# EAGLE design RxT6 (EAGLE 4.13)
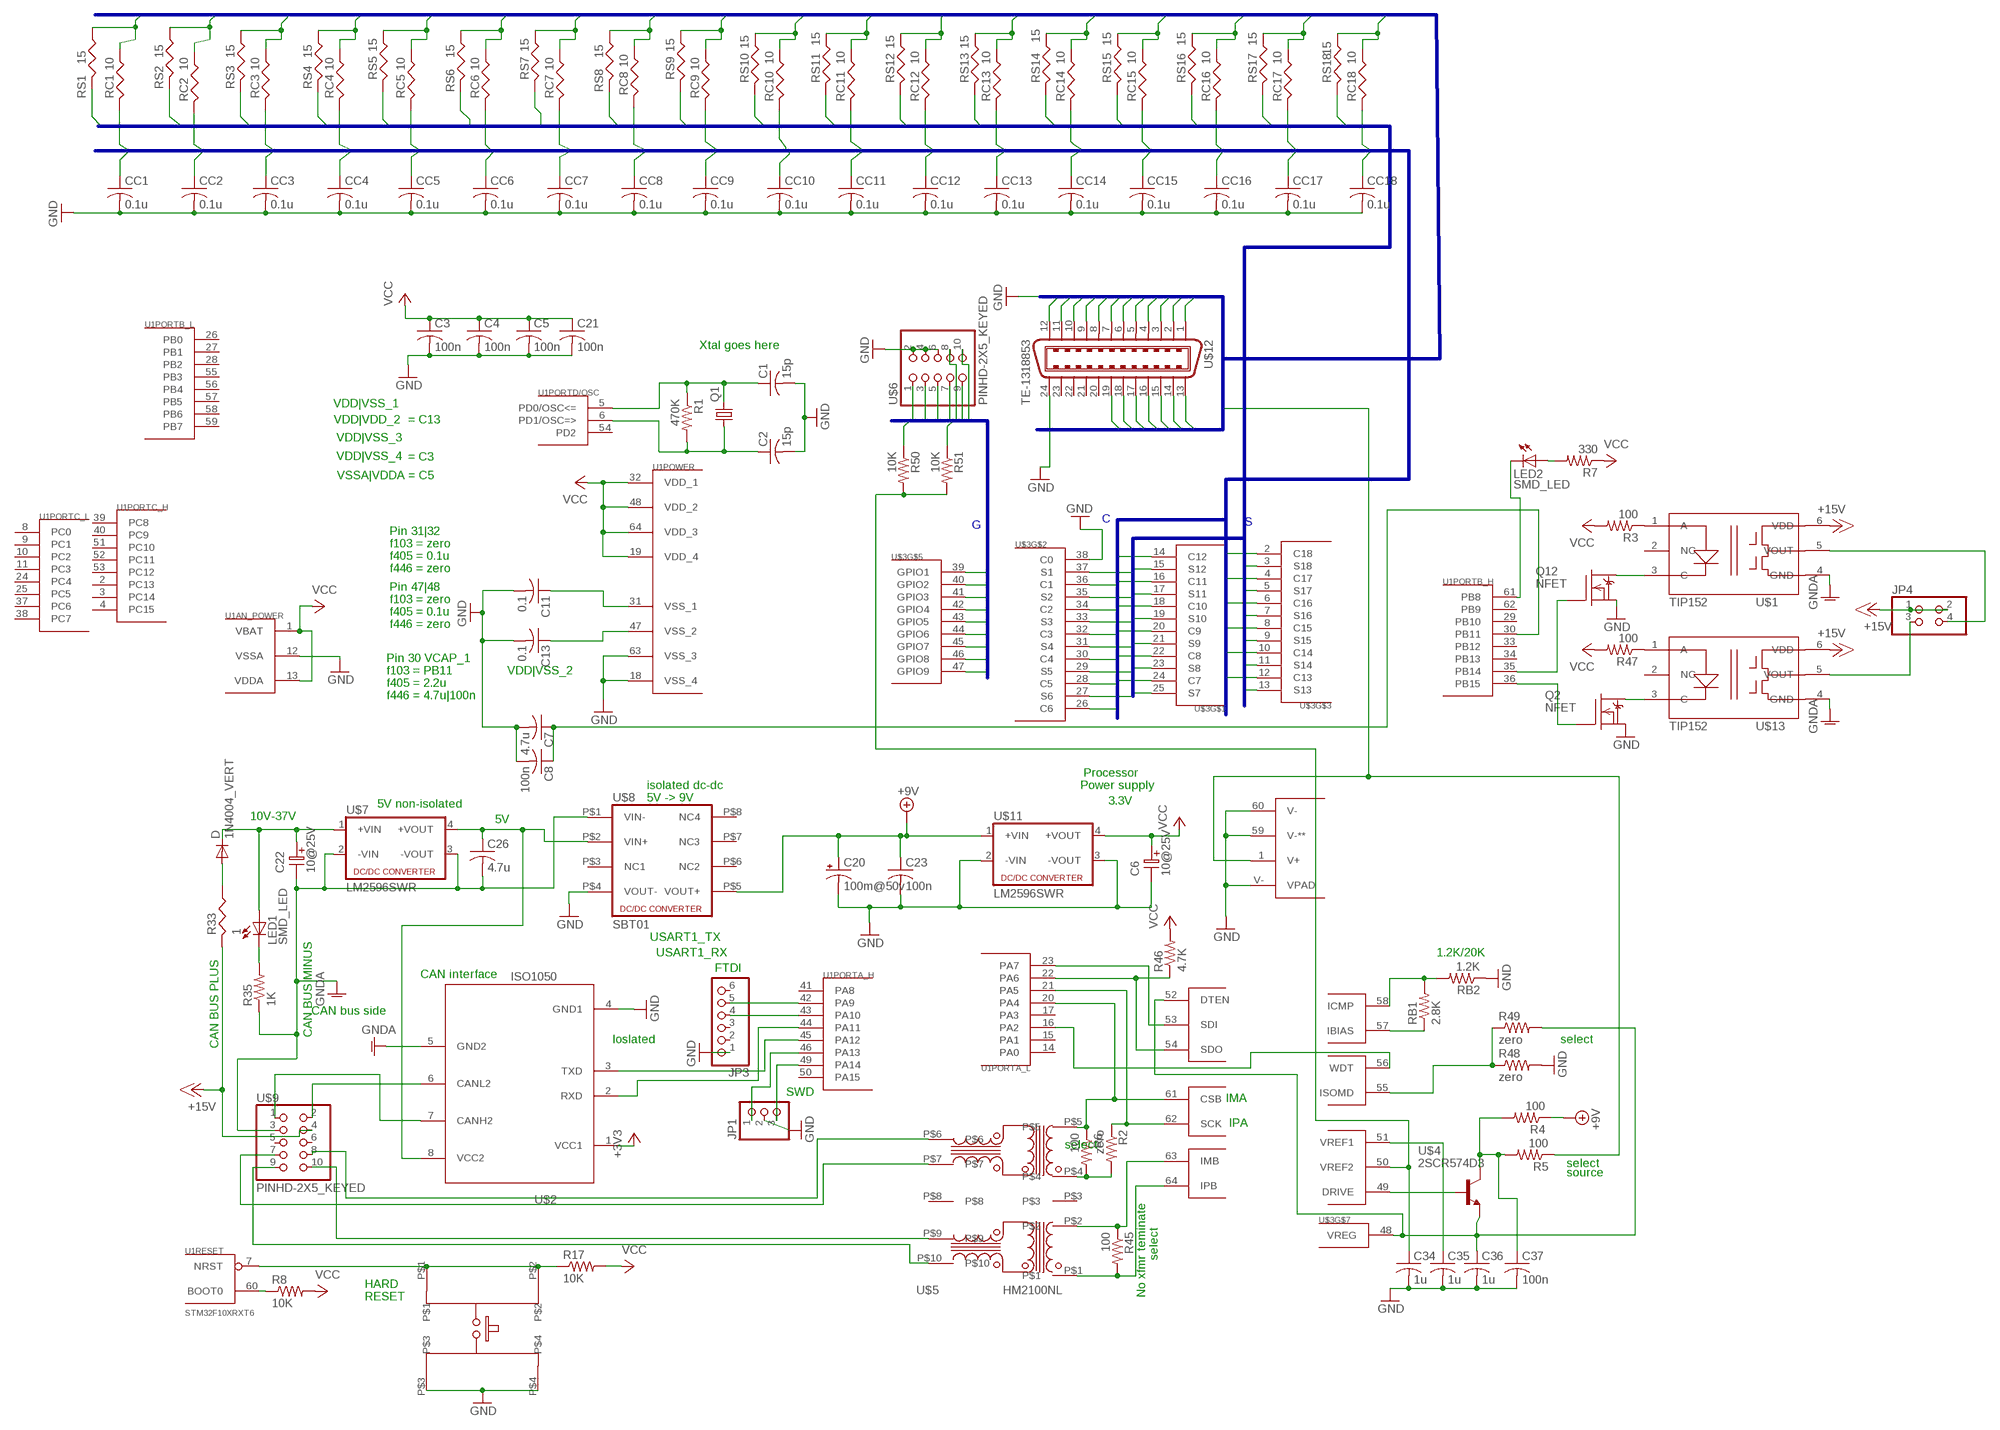
[diagram p0: schematic, sheet 1]

## Parts
C1  15p  C-USC0603  [C0603]
C2  15p  C-USC0603  [C0603]
C3  100n  C-USC0603  [C0603]
C4  100n  C-USC0603  [C0603]
C5  100n  C-USC0603  [C0603]
C6  10@25V  ELC-2,5L  [ES-2,5L]
C7  4.7u  C-USC0603  [C0603]
C8  100n  C-USC0603  [C0603]
C11  0.1  C-USC0603  [C0603]
C13  0.1  C-USC0603  [C0603]
C20  100m@50v  CPOL-USE5-8.5  [E5-8,5]
C21  100n  C-USC0603  [C0603]
C22  10@25V  ELC-2,5L  [ES-2,5L]
C23  100n  C-USC0603  [C0603]
C26  4.7u  C-USC0603  [C0603]
C34  1u  C-USC0603  [C0603]
C35  1u  C-USC0603  [C0603]
C36  1u  C-USC0603  [C0603]
C37  100n  C-USC0603  [C0603]
CC1  0.1u  C-USC0805  [C0805]
CC2  0.1u  C-USC0805  [C0805]
CC3  0.1u  C-USC0805  [C0805]
CC4  0.1u  C-USC0805  [C0805]
CC5  0.1u  C-USC0805  [C0805]
CC6  0.1u  C-USC0805  [C0805]
CC7  0.1u  C-USC0805  [C0805]
CC8  0.1u  C-USC0805  [C0805]
CC9  0.1u  C-USC0805  [C0805]
CC10  0.1u  C-USC0805  [C0805]
CC11  0.1u  C-USC0805  [C0805]
CC12  0.1u  C-USC0805  [C0805]
CC13  0.1u  C-USC0805  [C0805]
CC14  0.1u  C-USC0805  [C0805]
CC15  0.1u  C-USC0805  [C0805]
CC16  0.1u  C-USC0805  [C0805]
CC17  0.1u  C-USC0805  [C0805]
CC18  0.1u  C-USC0805  [C0805]
D  1N4004_VERT  [DO41-10_VERT]
JP1  PINHD-1X3  [1X03]
JP3  PINHD-1X6  [1X06]
JP4  PINHD-2X2  [2X02]
LED1  SMD_LED  [SMD_LED]
LED2  SMD_LED  [SMD_LED]
Q1  CRYTALHC49S  [HC49/S]
Q2  NFET  DMN3404L  [SOT-23]
Q12  NFET  DMN3404L  [SOT-23]
R1  470K  R-US_R0603  [R0603]
R2  zero  R-US_R0603  [R0603]
R3  100  R-US_R0603  [R0603]
R4  100  R-US_R0603  [R0603]
R5  100  R-US_R0603  [R0603]
R6  100  R-US_R0603  [R0603]
R7  330  R-US_R0603  [R0603]
R8  10K  R-US_R0603  [R0603]
R17  10K  R-US_R0603  [R0603]
R33  1  RESUS-S2,5  [RS-2,5]
R35  1K  R-US_R0603  [R0603]
R45  100  R-US_R0603  [R0603]
R46  4.7K  R-US_R0603  [R0603]
R47  100  R-US_R0603  [R0603]
R48  zero  R-US_R0603  [R0603]
R49  zero  R-US_R0603  [R0603]
R50  10K  R-US_R0603  [R0603]
R51  10K  R-US_R0603  [R0603]
RB1  2.8K  R-US_R0603  [R0603]
RB2  1.2K  R-US_R0603  [R0603]
RC1  10  RESUS-S2,5  [RS-2,5]
RC2  10  RESUS-S2,5  [RS-2,5]
RC3  10  RESUS-S2,5  [RS-2,5]
RC4  10  RESUS-S2,5  [RS-2,5]
RC5  10  RESUS-S2,5  [RS-2,5]
RC6  10  RESUS-S2,5  [RS-2,5]
RC7  10  RESUS-S2,5  [RS-2,5]
RC8  10  RESUS-S2,5  [RS-2,5]
RC9  10  RESUS-S2,5  [RS-2,5]
RC10  10  RESUS-S2,5  [RS-2,5]
RC11  10  RESUS-S2,5  [RS-2,5]
RC12  10  RESUS-S2,5  [RS-2,5]
RC13  10  RESUS-S2,5  [RS-2,5]
RC14  10  RESUS-S2,5  [RS-2,5]
RC15  10  RESUS-S2,5  [RS-2,5]
RC16  10  RESUS-S2,5  [RS-2,5]
RC17  10  RESUS-S2,5  [RS-2,5]
RC18  10  RESUS-S2,5  [RS-2,5]
RS1  15  RESUS-S2,5  [RS-2,5]
RS2  15  RESUS-S2,5  [RS-2,5]
RS3  15  RESUS-S2,5  [RS-2,5]
RS4  15  RESUS-S2,5  [RS-2,5]
RS5  15  RESUS-S2,5  [RS-2,5]
RS6  15  RESUS-S2,5  [RS-2,5]
RS7  15  RESUS-S2,5  [RS-2,5]
RS8  15  RESUS-S2,5  [RS-2,5]
RS9  15  RESUS-S2,5  [RS-2,5]
RS10  15  RESUS-S2,5  [RS-2,5]
RS11  15  RESUS-S2,5  [RS-2,5]
RS12  15  RESUS-S2,5  [RS-2,5]
RS13  15  RESUS-S2,5  [RS-2,5]
RS14  15  RESUS-S2,5  [RS-2,5]
RS15  15  RESUS-S2,5  [RS-2,5]
RS16  15  RESUS-S2,5  [RS-2,5]
RS17  15  RESUS-S2,5  [RS-2,5]
RS18  15  RESUS-S2,5  [RS-2,5]
SW1  E-SWITCH  [E-SWITCH]
U1  STM32F10XRXT6  [TQFP64]
U$1  TIP152  SI826  [SDIP6]
U$2  ISO1050  [PDSO-G8]
U$3  LTC6813  [TQFP64_PAD]
U$4  2SCR574D3  [TO252]
U$5  HM2100NL  [PULSE]
U$6  PINHD-2X5_KEYED  [2X05_KEYED]
U$7  LM2596SWR  [LM2596SW]
U$8  SBT01  [SBT01]
U$9  PINHD-2X5_KEYED  [2X05_KEYED]
U$11  LM2596SWR  [LM2596SW]
U$12  TE-1318853  [TE-CONN-24]
U$13  TIP152  SI826  [SDIP6]

## Nets
5V_CANSIDE: C26.1 U$2.8(VCC2) U$7.4(+VOUT) U$8.P$2(VIN+)
+3V3: U$2.1(VCC1)
+9V: C20.+ C23.1 R4.1 U$8.P$5(VOUT+) U$11.1(+VIN)
+12V_RESISTORED: D.A R33.1
+15V: JP4.1 JP4.2 R33.2 U$1.6(VDD) U$9.4 U$13.6(VDD)
BOOT0: R8.1 U1.60(RESET:BOOT0)
C1: CC1.1 RC1.2 U$3.36(C1)
C2: CC2.1 RC2.2 U$3.34(C2)
C3: CC3.1 RC3.2 U$3.32(C3)
C4: CC4.1 RC4.2 U$3.30(C4)
C5: CC5.1 RC5.2 U$3.28(C5)
C6: CC6.1 RC6.2 U$3.26(C6)
C7: CC7.1 RC7.2 U$3.24(C7)
C8: CC8.1 RC8.2 U$3.22(C8)
C9: CC9.1 RC9.2 U$3.20(C9)
C10: CC10.1 RC10.2 U$3.18(C10)
C11: CC11.1 RC11.2 U$3.16(C11)
C12: CC12.1 RC12.2 U$3.14(C12)
C13: CC13.1 RC13.2 U$3.12(C13)
C14: CC14.1 RC14.2 U$3.10(C14)
C15: CC15.1 RC15.2 U$3.8(C15)
C16: CC16.1 RC16.2 U$3.6(C16)
C17: CC17.1 RC17.2 U$3.4(C17)
C18: CC18.1 RC18.2 U$3.2(C18)
CAN_PROTECTED+: C22.1 D.C LED1.A U$7.1(+VIN)
CANH: U$2.7(CANH2) U$9.1
CANL: U$2.6(CANL2) U$9.2
DRIVE: U$3.49(DRIVE) U$4.1(B)
G1: R50.1 U$3.39(GPIO1) U$6.1
G2: R51.1 U$3.40(GPIO2) U$6.3
G3: U$3.41(GPIO3) U$6.5
G4: U$3.42(GPIO4) U$6.7
G5: U$3.43(GPIO5) U$6.8
G6: U$3.44(GPIO6) U$6.9
G7: U$3.45(GPIO7) U$6.10
G8: U$3.46(GPIO8)
G9: U$3.47(GPIO9)
GND: C1.2 C2.2 C3.2 C4.2 C5.2 C6.2 C7.2 C8.2 C11.2 C13.2 C20.- C21.2 C23.2 C34.2 C35.2 C36.2 C37.2 CC1.2 CC2.2 CC3.2 CC4.2 CC5.2 CC6.2 CC7.2 CC8.2 CC9.2 CC10.2 CC11.2 CC12.2 CC13.2 CC14.2 CC15.2 CC16.2 CC17.2 CC18.2 JP1.2 JP3.1 Q2.2(S) Q12.2(S) R48.2 RB2.1 SW1.P$3 SW1.P$4 U1.12(AN_POWER:VSSA) U1.18(POWER:VSS_4) U1.63(POWER:VSS_3) U$2.4(GND1) U$3.38(C0) U$3.59(V-**) U$3.60(V-) U$3.V-(VPAD) U$6.2 U$6.4 U$6.6 U$8.P$4(VOUT-) U$11.2(-VIN) U$11.3(-VOUT) U$12.24
GNDA: C22.2 C26.2 R35.1 U$1.4(GND) U$2.5(GND2) U$7.2(-VIN) U$7.3(-VOUT) U$8.P$1(VIN-) U$9.3 U$13.4(GND)
IBIAS: RB1.1 U$3.57(IBIAS)
ICMP: RB1.2 RB2.2 U$3.58(ICMP)
ISOMD: R48.1 R49.1 U$3.55(ISOMD)
ISOSPI-A-N: U$5.P$6 U$9.8
ISOSPI-A-P: U$5.P$7 U$9.7
ISOSPI-B-N: U$5.P$9 U$9.10
ISOSPI-B-P: U$5.P$10 U$9.9
JTCK: JP1.3 U1.49(PORTA_H:PA14)
JTMS: JP1.1 U1.46(PORTA_H:PA13)
LED_BUS_PWR: LED1.C R35.2
LED|R: LED2.A R7.2
N$1: R45.2 U$3.64(IPB) U$5.P$1
N$3: JP4.3 U$13.5(VOUT)
N$4: R45.1 U$3.63(IMB) U$5.P$2
N$6: R2.2 R6.2 U$5.P$4
N$8: JP4.4 U$1.5(VOUT)
N$10: R3.1 U$1.1(A)
N$11: R47.1 U$13.1(A)
N$12: Q12.3(D) U$1.3(C)
N$13: Q2.3(D) U$13.3(C)
N$14: Q2.1(G) U1.36(PORTB_H:PB15)
N$15: Q12.1(G) U1.35(PORTB_H:PB14)
NPN_COL: C37.1 R4.2 R5.2 U$4.3(C)
NRST: R17.1 SW1.P$1 SW1.P$2 U1.7(RESET:NRST)
PA2|WDT: U1.16(PORTA_L:PA2) U$3.56(WDT)
PA9_USART1_TX: JP3.5 U1.42(PORTA_H:PA9)
PA10_USART1_RX: JP3.4 U1.43(PORTA_H:PA10)
PA11_CANRXD: U1.44(PORTA_H:PA11) U$2.2(RXD)
PA12-CANTXD: U1.45(PORTA_H:PA12) U$2.3(TXD)
PB8|LED: LED2.C U1.61(PORTB_H:PB8)
PB11|VCAP: C7.1 C8.1 U1.30(PORTB_H:PB11)
PD0_OSC_IN_XTAL: C1.1 Q1.2 R1.1 U1.5(PORTD/OSC:PD0/OSC<=)
PD1_OSC_OUT: C2.1 Q1.1 R1.2 U1.6(PORTD/OSC:PD1/OSC=>)
S1: RS1.2 U$3.37(S1)
S2: RS2.2 U$3.35(S2)
S3: RS3.2 U$3.33(S3)
S4: RS4.2 U$3.31(S4)
S5: RS5.2 U$3.29(S5)
S6: RS6.2 U$3.27(S6)
S7: RS7.2 U$3.25(S7)
S8: RS8.2 U$3.23(S8)
S9: RS9.2 U$3.21(S9)
S10: RS10.2 U$3.19(S10)
S11: RS11.2 U$3.17(S11)
S12: RS12.2 U$3.15(S12)
S13: RS13.2 U$3.13(S13)
S14: RS14.2 U$3.11(S14)
S15: RS15.2 U$3.9(S15)
S16: RS16.2 U$3.7(S16)
S17: RS17.2 U$3.5(S17)
S18: RS18.2 U$3.3(S18)
SP1_MISO-SDO: R46.1 U1.22(PORTA_L:PA6) U$3.54(SDO)
SP1_NSS-CSB: R6.1 U1.20(PORTA_L:PA4) U$3.61(CSB) U$5.P$5
SPI1_MOSI-SDI: U1.23(PORTA_L:PA7) U$3.53(SDI)
SPI1_SCK-CLK: R2.1 U1.21(PORTA_L:PA5) U$3.62(SCK)
VCC: C3.1 C4.1 C5.1 C6.1 C21.1 R3.2 R7.1 R8.2 R17.2 R46.2 R47.2 U1.1(AN_POWER:VBAT) U1.13(AN_POWER:VDDA) U1.19(POWER:VDD_4) U1.32(POWER:VDD_1) U1.48(POWER:VDD_2) U1.64(POWER:VDD_3) U$11.4(+VOUT)
VREF1: C35.1 U$3.51(VREF1)
VREF2: C34.1 R50.2 R51.2 U$3.50(VREF2)
VREG: C36.1 R49.2 U$3.48(VREG) U$3.52(DTEN) U$4.2(E)
VSS_1: C11.1 U1.31(POWER:VSS_1)
VSS_2: C13.1 U1.47(POWER:VSS_2)
X0: U$12.1
X1: RC1.1 RS1.1 U$12.2
X2: RC2.1 RS2.1 U$12.3
X3: RC3.1 RS3.1 U$12.4
X4: RC4.1 RS4.1 U$12.5
X5: RC5.1 RS5.1 U$12.6
X6: RC6.1 RS6.1 U$12.7
X7: RC7.1 RS7.1 U$12.8
X8: RC8.1 RS8.1 U$12.9
X9: RC9.1 RS9.1 U$12.10
X10: RC10.1 RS10.1 U$12.11
X11: RC11.1 RS11.1 U$12.12
X12: RC12.1 RS12.1 U$12.13
X13: RC13.1 RS13.1 U$12.14
X14: RC14.1 RS14.1 U$12.15
X15: RC15.1 RS15.1 U$12.16
X16: RC16.1 RS16.1 U$12.17
X17: RC17.1 RS17.1 U$12.18
X18: R5.1 RC18.1 RS18.1 U$3.1(V+) U$12.19
Unconnected: JP3.2 JP3.3 JP3.6 U1.2(PORTC_H:PC13) U1.3(PORTC_H:PC14) U1.4(PORTC_H:PC15) U1.8(PORTC_L:PC0) U1.9(PORTC_L:PC1) U1.10(PORTC_L:PC2) U1.11(PORTC_L:PC3) U1.14(PORTA_L:PA0) U1.15(PORTA_L:PA1) U1.17(PORTA_L:PA3) U1.24(PORTC_L:PC4) U1.25(PORTC_L:PC5) U1.26(PORTB_L:PB0) U1.27(PORTB_L:PB1) U1.28(PORTB_L:PB2) U1.29(PORTB_H:PB10) U1.33(PORTB_H:PB12) U1.34(PORTB_H:PB13) U1.37(PORTC_L:PC6) U1.38(PORTC_L:PC7) U1.39(PORTC_H:PC8) U1.40(PORTC_H:PC9) U1.41(PORTA_H:PA8) U1.50(PORTA_H:PA15) U1.51(PORTC_H:PC10) U1.52(PORTC_H:PC11) U1.53(PORTC_H:PC12) U1.54(PORTD/OSC:PD2) U1.55(PORTB_L:PB3) U1.56(PORTB_L:PB4) U1.57(PORTB_L:PB5) U1.58(PORTB_L:PB6) U1.59(PORTB_L:PB7) U1.62(PORTB_H:PB9) U$1.2(NC) U$5.P$3 U$5.P$8 U$8.P$3(NC1) U$8.P$6(NC2) U$8.P$7(NC3) U$8.P$8(NC4) U$9.5 U$9.6 U$12.20 U$12.21 U$12.22 U$12.23 U$13.2(NC)

## Buses
G[1..9]
C[0..18]
X[1..18],GND
S[1..18]

## Notes on the sheet
- Xtal goes here
- VDD|VSS_1
- VDD|VDD_2 | = C13
- VDD|VSS_3
- VDD|VSS_4
- = C3
- VSSA|VDDA = C5
- C | S
- G
- Pin 31|32
- f103 = zero
- f405 = 0.1u
- f446 = zero
- Pin 47|48
- f103 = zero
- f405 = 0.1u
- f446 = zero
- Pin 30 VCAP_1
- f103 = PB11 | VDD|VSS_2
- f405 = 2.2u
- f446 = 4.7u|100n
- Processor
- isolated dc-dc | Power supply
- 5V -> 9V | 3.3V
- 5V non-isolated
- 10V-37V | 5V
- USART1_TX
- CAN BUS PLUS | USART1_RX | 1.2K/20K
- FTDI
- CAN interface
- CAN bus side
- CAN BUS MINUS
- Ioslated | select
- SWD
- IMA
- IPA
- select
- select
- source
- select
- HARD
- RESET | No xfmr teminate

## Library data of the parts
C1-C5 C7 C8 C11 C13 C21 C23 C26 C34-C37 CC1-CC18 = rcl:C-US: CAPACITOR, American symbol
C6 C22 = DEH:ELC-2,5L
C20 = rcl:CPOL-US: POLARIZED CAPACITOR, American symbol
D = diode:1N4004_VERT
JP1 = pinhead:PINHD-1X3: PIN HEADER
JP3 = pinhead:PINHD-1X6: PIN HEADER
JP4 = pinhead:PINHD-2X2: PIN HEADER
LED1 LED2 = led:SMD_LED
Q1 = crystal:CRYTAL: CRYSTAL
Q2 Q12 = transistor-fet:DMN3404L
R1-R8 R17 R35 R45-R51 RB1 RB2 = rcl:R-US_: RESISTOR, American symbol
R33 RC1-RC18 RS1-RS18 = DEH:RESUS-S2,5
SW1 = switch-misc:E-SWITCH
U1 = stm32:STM32F10XRXT6: STM32F101/103 64pin LQFP
U$1 U$13 = DEH:SI826
U$2 = texas:ISO1050
U$3 = stm32:LTC6813
U$4 = transistor-npn:2SCR574D3
U$5 = DEH:HM2100NL
U$6 U$9 = pinhead:PINHD-2X5_KEYED
U$7 U$11 = dc-dc-converter:LM2596SWR
U$8 = dc-dc-converter:SBT01
U$12 = DEH:TE-1318853

## Board
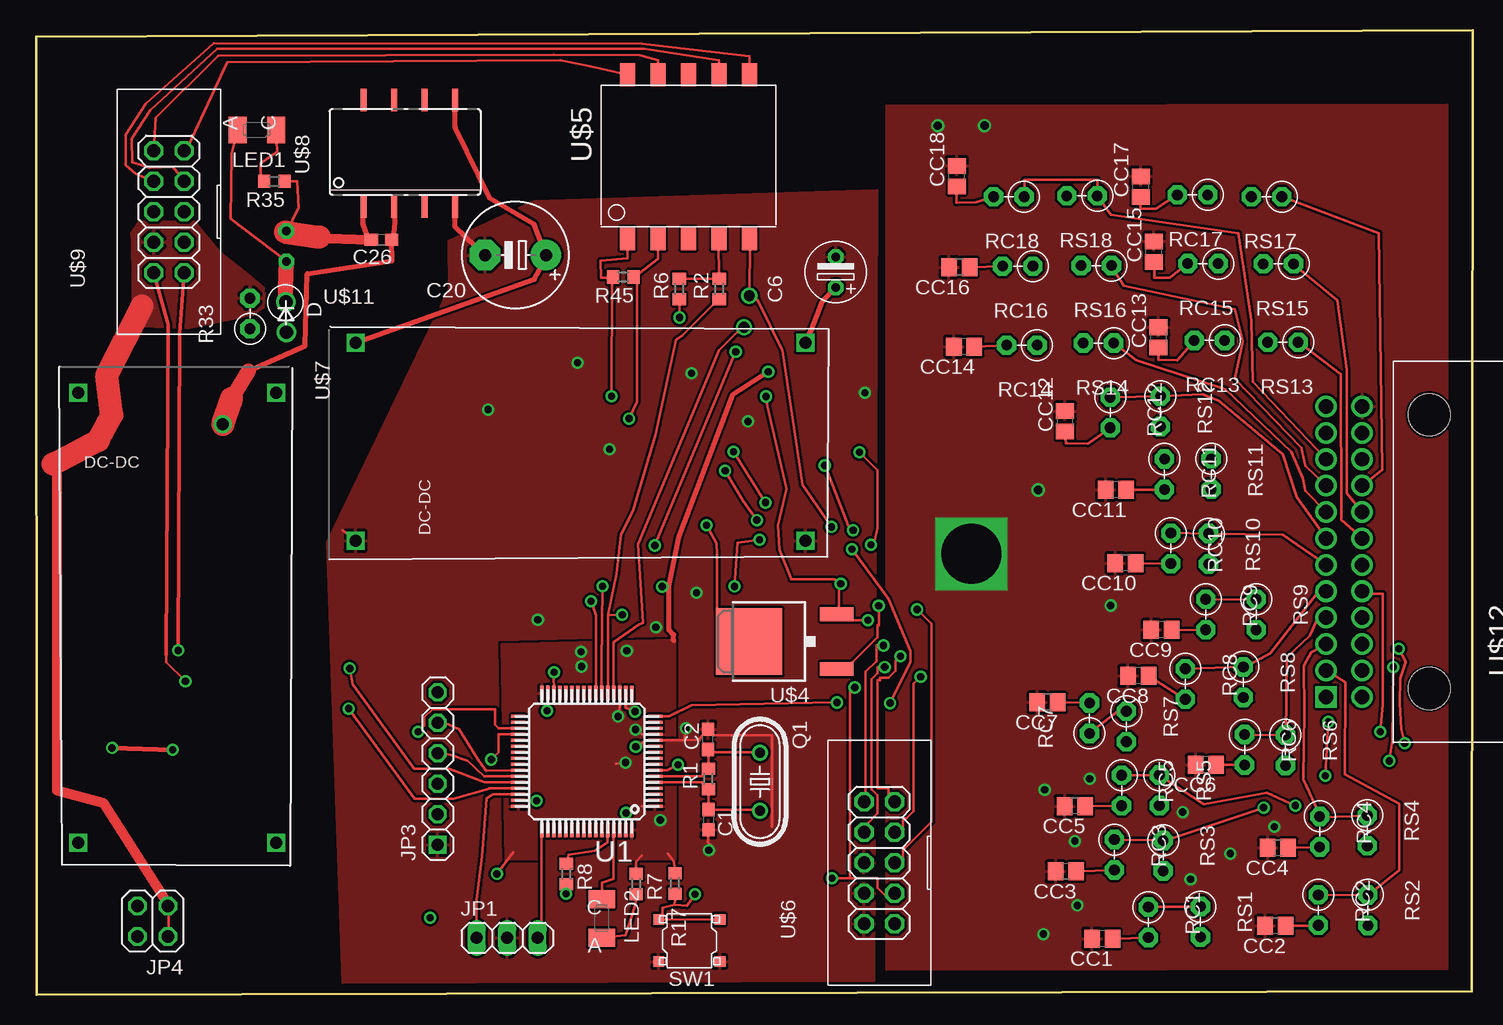
[diagram p1: board, top side]
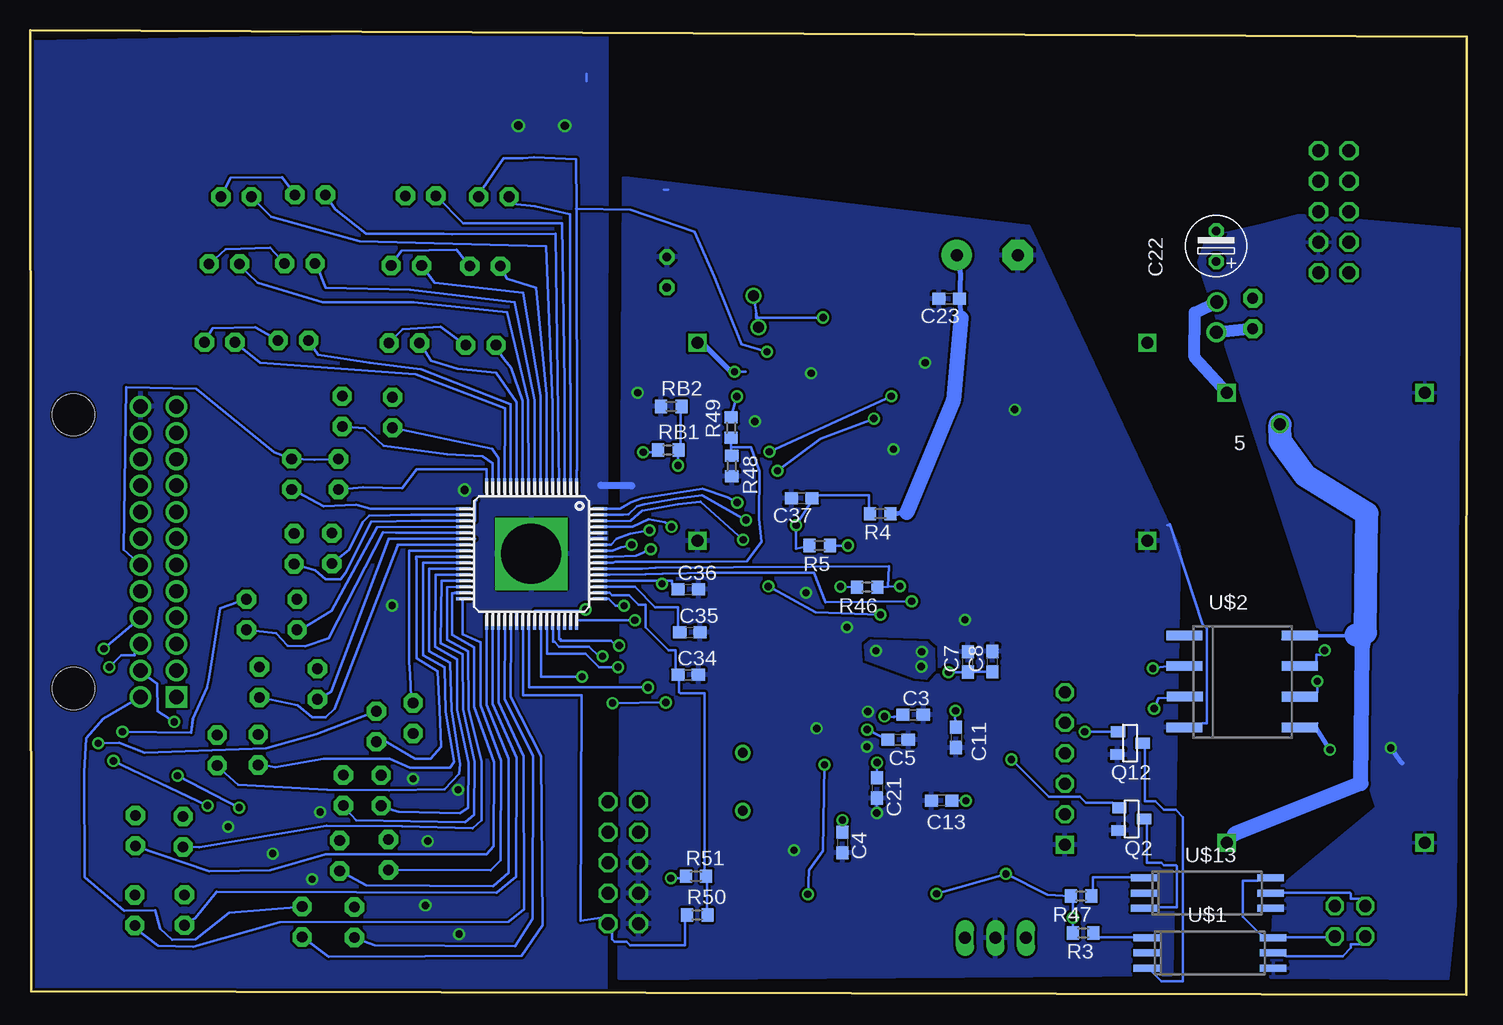
[diagram p2: board, bottom side, seen from below]

Size 119.75 x 80.39 mm. Coordinates in mm from the lower left corner, seen from the top.
Outline: 0.03,0 0,79.83 119.75,80.39 119.65,0.27 0.03,0
Copper layers (1*16): Top 0.035mm / dielectric 1.5mm / Bottom 0.035mm
Design rules "default": minimum track width 8mil, minimum drill 0.6mm, track to track 0.2083mm, track to pad 8mil, pad to pad 8mil, via to via 8mil, smd to smd 0mil, copper to edge 8mil, drill to drill 8mil, minimum pad ring 10mil, minimum via ring 8mil, stop-mask expansion 4mil, vias tented up to drill 0mil, thermal gap 10mil

### Footprints (pad centres in the part's own frame; a part is rotated, then mirrored left to right if it is on the bottom)
C0603 = smd 1.1 x 1: 1 -0.85,0; 2 0.85,0
ES-2,5L = drill 0.711 pad 1.27 octagon: 1 0,0; 2 2.54,0
E5-8,5 = drill 1 pad 2.54 round: + -2.54,0 | drill 1 pad 2.54 octagon: - 2.54,0
C0805 = smd 1.3 x 1.5: 1 -0.85,0; 2 0.85,0
DO41-10_VERT = drill 1.1 round: A 2.58,0.05; C 0.07,0
1X03 = drill 1 long: 1 -2.54,0; 2 0,0; 3 2.54,0
1X06 = drill 1 square: 1 -6.35,0 | drill 1 octagon: 2 -3.81,0; 3 -1.27,0; 4 1.27,0; 5 3.81,0; 6 6.35,0
2X02 = drill 1.016 octagon: 1 -1.27,-1.27; 2 -1.27,1.27; 3 1.27,-1.27; 4 1.27,1.27
SMD_LED = smd 2.2 x 1.5: A 0,1.6; C 0,-1.6
HC49/S = drill 0.813 round: 1 -2.413,0; 2 2.413,0
SOT-23 = smd 0.9 x 1.2: 1 -1,-1.006; 2 0.9,-1.056; 3 -0.05,1.056
R0603 = smd 1 x 1.1: 1 -0.85,0; 2 0.85,0
RS-2,5 = drill 0.889 pad 1.6 octagon: 1 0,0; 2 2.54,0
E-SWITCH = smd 0.9 x 0.9: P$1 -2.55,1.75; P$2 2.55,1.75; P$3 -2.55,-1.75; P$4 2.55,-1.75
TQFP64 = smd 1.2 x 0.26: 1 -5.7,3.75; 2 -5.7,3.25; 3 -5.7,2.75; 4 -5.7,2.25; 5 -5.7,1.75; 6 -5.7,1.25; 7 -5.7,0.75; 8 -5.7,0.25; 9 -5.7,-0.25; 10 -5.7,-0.75; 11 -5.7,-1.25; 12 -5.7,-1.75; 13 -5.7,-2.25; 14 -5.7,-2.75; 15 -5.7,-3.25; 16 -5.7,-3.75; 33 5.7,-3.75; 34 5.7,-3.25; 35 5.7,-2.75; 36 5.7,-2.25; 37 5.7,-1.75; 38 5.7,-1.25; 39 5.7,-0.75; 40 5.7,-0.25; 41 5.7,0.25; 42 5.7,0.75; 43 5.7,1.25; 44 5.7,1.75; 45 5.7,2.25; 46 5.7,2.75; 47 5.7,3.25; 48 5.7,3.75 | smd 0.26 x 1.2: 17 -3.75,-5.7; 18 -3.25,-5.7; 19 -2.75,-5.7; 20 -2.25,-5.7; 21 -1.75,-5.7; 22 -1.25,-5.7; 23 -0.75,-5.7; 24 -0.25,-5.7; 25 0.25,-5.7; 26 0.75,-5.7; 27 1.25,-5.7; 28 1.75,-5.7; 29 2.25,-5.7; 30 2.75,-5.7; 31 3.25,-5.7; 32 3.75,-5.7; 49 3.75,5.7; 50 3.25,5.7; 51 2.75,5.7; 52 2.25,5.7; 53 1.75,5.7; 54 1.25,5.7; 55 0.75,5.7; 56 0.25,5.7; 57 -0.25,5.7; 58 -0.75,5.7; 59 -1.25,5.7; 60 -1.75,5.7; 61 -2.25,5.7; 62 -2.75,5.7; 63 -3.25,5.7; 64 -3.75,5.7
SDIP6 = smd 0.6 x 2.2: 1 -1.895,-5.33; 2 -0.625,-5.33; 3 0.645,-5.33; 4 0.645,5.22; 5 -0.625,5.22; 6 -1.895,5.22
PDSO-G8 = smd 0.8 x 3: 1 -3.825,-4.8; 2 -1.275,-4.8; 3 1.265,-4.78; 4 3.825,-4.8; 5 3.825,4.8; 6 1.275,4.8; 7 -1.275,4.81; 8 -3.825,4.81
TQFP64_PAD = smd 1.2 x 0.26: 1 -5.7,3.75; 2 -5.7,3.25; 3 -5.7,2.75; 4 -5.7,2.25; 5 -5.7,1.75; 6 -5.7,1.25; 7 -5.7,0.75; 8 -5.7,0.25; 9 -5.7,-0.25; 10 -5.7,-0.75; 11 -5.7,-1.25; 12 -5.7,-1.75; 13 -5.7,-2.25; 14 -5.7,-2.75; 15 -5.7,-3.25; 16 -5.7,-3.75; 33 5.7,-3.75; 34 5.7,-3.25; 35 5.7,-2.75; 36 5.7,-2.25; 37 5.7,-1.75; 38 5.7,-1.25; 39 5.7,-0.75; 40 5.7,-0.25; 41 5.7,0.25; 42 5.7,0.75; 43 5.7,1.25; 44 5.7,1.75; 45 5.7,2.25; 46 5.7,2.75; 47 5.7,3.25; 48 5.7,3.75 | smd 0.26 x 1.2: 17 -3.75,-5.7; 18 -3.25,-5.7; 19 -2.75,-5.7; 20 -2.25,-5.7; 21 -1.75,-5.7; 22 -1.25,-5.7; 23 -0.75,-5.7; 24 -0.25,-5.7; 25 0.25,-5.7; 26 0.75,-5.7; 27 1.25,-5.7; 28 1.75,-5.7; 29 2.25,-5.7; 30 2.75,-5.7; 31 3.25,-5.7; 32 3.75,-5.7; 49 3.75,5.7; 50 3.25,5.7; 51 2.75,5.7; 52 2.25,5.7; 53 1.75,5.7; 54 1.25,5.7; 55 0.75,5.7; 56 0.25,5.7; 57 -0.25,5.7; 58 -0.75,5.7; 59 -1.25,5.7; 60 -1.75,5.7; 61 -2.25,5.7; 62 -2.75,5.7; 63 -3.25,5.7; 64 -3.75,5.7 | smd 5.8 x 5.8: V- 0,0
TO252 = smd 1.15 x 2.77: 1 -2.28,-7.34; 2 2.28,-7.34 | smd 5.55 x 5.5: 3 0,-0.04
PULSE = smd 1.27 x 1.9: P$1 -5.08,-6.78; P$2 -2.54,-6.78; P$3 0,-6.78; P$4 2.54,-6.78; P$5 5.08,-6.78; P$6 5.08,6.88; P$7 2.54,6.88; P$8 0,6.88; P$9 -2.54,6.88; P$10 -5.08,6.88
2X05_KEYED = drill 1.067 octagon: 1 -5.08,-1.27; 2 -5.08,1.27; 3 -2.54,-1.27; 4 -2.54,1.27; 5 0,-1.27; 6 0,1.27; 7 2.54,-1.27; 8 2.54,1.27; 9 5.08,-1.27; 10 5.08,1.27
LM2596SW = drill 1 square: 1 0,16.5; 2 0,0; 3 37.5,0; 4 37.5,16.5
SBT01 = smd 0.5 x 1.85: P$1 -3.5,-4.63; P$2 -0.96,-4.63; P$3 1.58,-4.63; P$4 4.12,-4.63; P$5 4.12,4.26; P$6 1.58,4.26; P$7 -0.96,4.26; P$8 -3.5,4.26
TE-CONN-24 = drill 1.2 square: 1 12.1,0 | drill 1.2 round: 2 12.1,3; 3 9.9,0; 4 9.9,3; 5 7.7,0; 6 7.7,3; 7 5.5,0; 8 5.5,3; 9 3.3,0; 10 3.3,3; 11 1.1,0; 12 1.1,3; 13 -1.1,0; 14 -1.1,3; 15 -3.3,0; 16 -3.3,3; 17 -5.5,0; 18 -5.5,3; 19 -7.7,0; 20 -7.7,3; 21 -9.9,0; 22 -9.9,3; 23 -12.1,0; 24 -12.1,3 | hole 3.5: 11.4,8.6; -11.4,8.6

### Placement (x,y rotation side)
C1  56.03,14.59 270 top
C2  56.01,21.28 90 top
C3  46.14,23.33 0 bottom
C4  52.04,12.68 270 bottom
C5  47.39,21.26 0 bottom
C6  66.65,58.94 90 top
C7  41.56,27.74 90 bottom
C8  39.52,27.75 90 bottom
C11  42.54,21.45 270 bottom
C13  43.74,16.18 180 bottom
C20  39.95,61.64 180 top
C21  49.14,17.24 270 bottom
C22  20.86,61.1 90 bottom
C23  43.12,57.98 180 bottom
C26  28.78,62.9 180 top
C34  64.89,26.66 0 bottom
C35  64.74,30.2 0 bottom
C36  64.88,33.78 0 bottom
C37  55.42,41.35 180 bottom
CC1  88.87,4.67 180 top
CC2  103.29,5.73 180 top
CC3  85.83,10.27 180 top
CC4  103.51,12.23 180 top
CC5  86.58,15.72 180 top
CC6  97.5,19.16 180 top
CC7  84.3,24.36 180 top
CC8  91.87,26.57 180 top
CC9  93.8,30.4 180 top
CC10  90.8,35.97 180 top
CC11  90.01,42.07 180 top
CC12  85.77,47.78 90 top
CC13  93.56,54.77 90 top
CC14  77.35,54 180 top
CC15  93.17,61.92 90 top
CC16  76.95,60.62 180 top
CC17  92.08,67.34 90 top
CC18  76.73,68.21 90 top
D  20.81,57.79 270 top
JP1  39.26,4.73 0 top
JP3  33.47,18.85 90 top
JP4  9.71,6.12 180 top
LED1  18.39,72.07 90 top
LED2  47.13,6.36 180 top
Q1  60.33,17.75 270 top
Q2  27.93,14.59 270 bottom
Q12  28.05,20.91 270 bottom
R1  56.03,17.98 90 top
R2  56.93,58.82 90 top
R3  31.95,5.14 180 bottom
R4  48.86,40.08 180 bottom
R5  53.92,37.43 180 bottom
R6  53.6,58.82 90 top
R7  50.01,9.24 270 top
R8  44.19,10.07 270 top
R17  53.24,9.27 90 top
R33  17.82,55.5 90 top
R35  19.85,67.78 180 top
R45  48.94,59.81 180 top
R46  49.96,33.96 180 bottom
R47  32.13,8.22 180 bottom
R48  61.25,44.06 270 bottom
R49  61.31,47.25 90 bottom
R50  64.13,6.64 0 bottom
R51  64.23,9.87 0 bottom
RB1  66.54,45.39 0 bottom
RB2  66.29,49.02 0 bottom
RC1  92.71,7.3 270 top
RC2  106.87,8.32 270 top
RC3  89.88,12.93 270 top
RC4  106.99,14.85 270 top
RC5  90.48,18.29 270 top
RC6  100.73,21.68 270 top
RC7  87.81,21.77 90 top
RC8  95.79,27.16 270 top
RC9  97.49,32.95 270 top
RC10  94.58,38.46 270 top
RC11  94.05,44.64 270 top
RC12  89.53,49.78 270 top
RC13  99.07,54.52 180 top
RC14  83.43,54.13 180 top
RC15  98.53,60.93 180 top
RC16  83.09,60.71 180 top
RC17  97.66,66.65 180 top
RC18  82.35,66.5 180 top
RS1  97.06,7.34 270 top
RS2  111.01,8.31 270 top
RS3  93.94,12.85 270 top
RS4  110.96,14.94 270 top
RS5  93.63,18.3 270 top
RS6  104.14,21.64 270 top
RS7  90.88,23.62 270 top
RS8  100.63,27.31 270 top
RS9  101.7,32.95 270 top
RS10  97.73,38.43 270 top
RS11  97.94,44.65 270 top
RS12  93.72,49.88 270 top
RS13  105.2,54.37 180 top
RS14  89.82,54.3 180 top
RS15  104.82,60.9 180 top
RS16  89.64,60.76 180 top
RS17  103.83,66.49 180 top
RS18  88.45,66.57 180 top
SW1  54.44,4.51 0 top
U1  45.9,19.44 180 top
U$1  21.34,2.86 270 bottom
U$2  18.71,26.1 270 bottom
U$3  77.93,36.73 270 bottom
U$4  59.38,29.42 90 top
U$5  54.37,69.78 0 top
U$6  70.29,10.99 90 top
U$7  3.5,50.15 270 top
U$8  30.8,70.29 0 top
U$9  11.07,65.24 90 top
U$11  26.61,37.83 0 top
U$12  107.53,36.92 270 top
U$13  21.57,7.84 270 bottom

### Tracks (layer width: path | path; a pad name or v marks a point on that pad's centre or on a via)
5V_CANSIDE  (via drill 1)
  Top 0.406: 17.69,51.99 22.4,54.07 22.59,60.08 29.65,61.16 C26.1 29.8,62.98 29.9,64.36 U$8.P$2
  Top 1.27: 16.29,49.67 17.69,51.99
  Top 1.93: v15.56,47.53 16.29,49.67
  Bottom 0.203: 19.33,13.4 U$7.4 | U$2.8 15.34,29.61
  Bottom 0.305: 9.21,29.99 9.44,29.92 U$2.8
  Bottom 1.27: 19.33,13.4 8.8,17.61 8.7,28.9 8.44,30.17
  Bottom 1.93: 9.21,29.99 8.44,30.17 8.31,40.09 13.4,43.21 15.53,46.14 v15.56,47.53
+9V
  Top 0.203: C20.+ 42.5,61.68
  Top 0.406: U$8.P$5 34.92,72.26 37.8,66.38 41.52,64.19 42.52,61.56 C20.+ 42.57,61.59 41.52,59.61 U$11.1
  Bottom 0.406: C20.+ 42.49,61.46 42.17,60.04 C23.1 42.13,56.41 | R4.1 47.94,39.98 46.65,40.19
  Bottom 1.27: 42.13,56.41 42.79,49.53 46.65,40.19
+12V_RESISTORED
  Top 1.016: D.A 20.85,55.23
  Bottom 1.016: D.A 21,55.18 R33.1
+15V
  Top 0.203: JP4.2 11.03,5.6 11.03,6.7 JP4.1 10.63,8.1 | 1.73,43.3 1.41,44.22
  Top 0.813: 10.63,8.1 5.63,15.94 1.73,17 1.73,43.3
  Top 1.93: 8.82,57.41 5.89,51.67 6.31,48.29 5.17,46.19 1.41,44.22
  Bottom 0.203: U$13.6 17.43,9.5 18.63,9.5 18.63,6.5 17.13,5 U$1.6 15.03,4.8 11.73,4.8 JP4.2
  pour Top: 8.65,63.89 13.22,63.93 15.3,61.4 18.1,58.95 19,58.42 18.91,57.28 18.05,56.7 12.55,55.56 8.13,55.8 8.03,62.97
  pour Top: 8.58,64.37 13.15,64.41 15.23,61.88 17.61,60.01 18.93,58.9 18.84,57.76 17.98,57.18 12.71,61.39 8.29,61.63 7.96,63.45
BOOT0
  Top 0.203: U1.60 47.64,12.7 46.6,12.01 44.38,11.66 44.2,10.97 R8.1
C1
  Top 0.203: 92.74,4.76 RC1.2 92.78,4.74 CC1.1
  Bottom 0.203: U$3.36 80.16,31.01 80.18,24.66 77.8,19.86 77.85,6.34 79.31,4.02 91.02,4.14 RC1.2
C2
  Top 0.203: 106.91,5.76 RC2.2 106.87,5.76 CC2.1
  Bottom 0.203: U$3.34 81.18,24.25 79.19,19.73 79.25,9.83 80.84,8.49 104.19,8.56 105.98,6.39 106.94,5.85 RC2.2
C3
  Top 0.203: 89.91,10.4 RC3.2 CC3.1
  Bottom 0.203: U$3.32 83.68,32.98 83.68,30.04 82.17,29.37 82.19,24.11 80.47,19.49 80.53,11.22 81.34,10.38 89.84,10.4 RC3.2
C4
  Top 0.203: 107.08,12.31 RC4.2 107.05,12.3 CC4.1
  Bottom 0.203: U$3.30 84.99,33.97 84.99,29.58 83.21,28.62 83.19,23.78 82.1,19.42 82.12,14.53 82.84,13.85 88.75,14.04 95.02,14.07 105.64,12.27 106.92,12.35 RC4.2
C5
  Top 0.203: 90.56,15.65 RC5.2 90.48,15.73 CC5.1
  Bottom 0.203: U$3.28 85.94,34.98 86,29 84.13,27.96 84.13,23.75 83.2,19.33 83.21,15.59 83.89,15.13 89.01,15.23 90.52,15.67 RC5.2
C6
  Top 0.203: 100.46,19.13 RC6.2 100.75,19.16 CC6.1
  Bottom 0.203: U$3.26 86.98,35.98 86.98,28.27 85.17,27.29 85.1,23.56 84.4,19.4 84.73,18.92 88.06,18.91 89.76,19.66 95.29,19.66 99.33,18.96 100.37,19.18 RC6.2
C7
  Top 0.203: 87.55,24.36 RC7.2 87.84,24.33 CC7.1
  Bottom 0.203: U$3.24 88.13,36.98 88.13,27.75 88.08,26.65 87.96,24.79 87.88,24.35 RC7.2
C8
  Top 0.203: 95.84,24.61 RC8.2 95.85,24.57 CC8.1
  Bottom 0.203: 82.63,38 83.13,38 U$3.22 89.85,37.98 89.85,37.94 94.65,25.25 95.74,24.6 RC8.2
C9
  Top 0.203: 97.53,30.38 RC9.2 97.51,30.39 CC9.1
  Bottom 0.203: U$3.20 90.83,38.97 94.59,31.99 97.06,30.49 RC9.2
C10
  Top 0.203: 94.62,35.93 RC10.2 94.62,35.91 CC10.1
  Bottom 0.203: U$3.18 87.02,39.98 87.99,39.99 91.47,39.93 92.04,39.37 93.13,37.07 94.6,35.92 RC10.2
C11
  Top 0.203: RC11.2 94.05,42.08 CC11.1
  Bottom 0.203: U$3.16 81.67,43.79 87.52,43.79 88.74,42.22 91.98,42.29 94.08,42.09 RC11.2
C12
  Top 0.203: RC12.2 89.62,47.3 87.68,45.92 85.82,45.97 85.83,45.96 CC12.1
  Bottom 0.203: U$3.14 80.67,44.71 81.24,45.49 RC12.2
C13
  Top 0.203: 96.65,54.58 RC13.2 96.54,54.5 95.13,52.86 93.53,52.92 CC13.1
  Bottom 0.203: RC13.2 96.57,54.53 95.74,53.31 91.43,52.66 87.15,52.12 79.68,49.19 U$3.12
C14
  Top 0.203: 81.01,54.13 RC14.2 80.92,54.12 CC14.1
  Bottom 0.203: U$3.10 78.69,49.5 79.66,52.24 80.23,52.96 81.01,54.08 RC14.2
C15
  Top 0.203: 95.98,60.98 RC15.2 96,60.95 94.49,59.75 93.19,59.75 CC15.1
  Bottom 0.203: U$3.8 77.7,42.43 77.7,49.54 79.36,57.7 88.07,58.73 95.09,58.93 95.91,60.93 RC15.2
C16
  Top 0.203: 80.6,60.64 RC16.2 80.58,60.7 CC16.1
  Bottom 0.203: U$3.6 76.67,49.98 77.55,58.93 79.96,59.67 80.53,60.66 RC16.2
C17
  Top 0.203: 95.17,66.65 RC17.2 93.35,65.5 92.04,65.5 CC17.1
  Bottom 0.203: U$3.4 75.65,42.43 75.94,63.41 84.56,63.39 85.27,63.43 91.73,63.43 94.3,65.47 95.1,66.63 RC17.2
C18
  Top 0.203: 79.86,66.53 RC18.2 78.32,66.02 76.71,66.01 CC18.1
  Bottom 0.203: U$3.2 74.69,50.91 74.72,50.91 74.72,65.04 77.65,65.7 79.56,65.92 79.87,66.56 RC18.2
CAN_PROTECTED+
  Top 0.203: D.C 20.74,57.75 | C22.1 16.19,64.68 16.29,70.06 16.81,72.16 LED1.A
  Top 0.813: D.C 20.8,57.75
  Top 1.27: C22.1 20.81,58.88 20.78,57.86 D.C
  Bottom 1.016: U$7.1 22.67,53.13 22.66,56.83 20.78,57.73 D.C
CANH  (via drill 0.6)
  Top 0.305: U$9.1 11.94,55.11 v11.83,28.69
  Bottom 0.203: U$2.7 12.54,27.71 12.54,28.31 12.14,28.31 v11.83,28.69
CANL  (via drill 0.6)
  Top 0.203: v12.44,26.11 10.84,27.71 10.84,28.21 10.83,28.33
  Top 0.305: 10.83,28.33 11.02,55.83 U$9.2
  Bottom 0.203: v12.44,26.11 12.44,25.21 U$2.6
DRIVE  (via drill 0.6)
  Top 0.203: v70.23,32.4 70.23,30.8 70.13,30.8 70.13,29.8 68.03,27.7 U$4.1
  Bottom 0.203: v70.23,32.4 70.93,32.4 71.53,33 71.73,33 U$3.49
G1
  Bottom 0.203: R50.1 65.13,6.1 65.13,4.1 69.73,4.1 70.03,4.4 71.03,4.4 71.23,4.6 71.23,5.2 U$6.1 72.13,6.4 73.84,6.16 73.79,24.96 78.63,24.96 78.63,30.5 U$3.39
G2  (via drill 0.6)
  Top 0.203: 67.83,9.7 70.13,9.7 70.13,8.9 70.83,8.2 U$6.3 | v66.33,9.7 67.83,9.7 | v68.23,25.6 67.83,25.2 67.83,9.7
  Bottom 0.203: v66.33,9.7 65.53,9.7 R51.1 | v68.23,25.6 78.13,25.6 78.13,30.5 U$3.40
G3  (via drill 0.6)
  Top 0.203: v73.43,32.1 74.63,30.9 74.63,14.4 72.43,12.2 72.23,12.2 72.23,11.4 U$6.5
  Bottom 0.203: v73.43,32.1 73.43,32 77.63,32 77.63,31.6 U$3.41
G4  (via drill 0.6)
  Top 0.203: v73.73,26.5 73.13,25.9 73.13,15.3 72.53,14.7 72.23,14.7 72.23,13.9 U$6.7
  Bottom 0.203: v73.73,26.5 77.13,26.5 77.13,30.5 U$3.42
G5  (via drill 0.6)
  Top 0.203: v70.73,27.3 70.13,27.3 70.13,26.8 69.63,26.3 69.63,17.1 70.13,16.6 70.13,15.1 69.33,14.3 U$6.8
  Bottom 0.203: v70.73,27.3 72.33,27.3 73.43,28.4 76.63,28.4 76.63,30.5 U$3.43
G6  (via drill 0.6)
  Top 0.203: v72.03,28.2 71.63,27.8 71.63,27 71.03,26.4 70.33,26.4 70.33,26.2 70.13,26.2 70.13,17.2 71.03,17.2 71.03,16.6 U$6.9
  Bottom 0.203: v72.03,28.2 72.33,28.2 73.13,29 75.63,29 76.03,29.4 76.13,29.4 76.13,30.5 U$3.44
G7  (via drill 0.6)
  Top 0.203: v70.63,29.1 70.03,29.1 70.03,27.8 69.13,26.9 69.13,16.8 U$6.10
  Bottom 0.203: v70.63,29.1 70.93,29.1 71.33,29.5 75.53,29.5 75.53,29.6 75.63,29.6 75.63,30.5 U$3.45
GND  (via drill 0.6, 0.7, 5)
  Top 0.203: U$11.2 25.53,38.7 | 56.2,12.49 56,12.69 C1.2 | 61.33,14 61.33,21.6 56.43,21.6 C2.2 55.53,21.6 55.23,21.3 55.23,21.23 | 55.23,21.23 55.23,21.2 | U1.12 53.87,21.21 50.81,21.18 v49.98,20.66 | 68.23,6.2 U$6.2 | v54.17,22.19 54.19,22.16 53.98,21.19 55.25,21.23 55.23,21.23 | U1.18 49.14,23.91 v49.91,23.59 | U1.63 v49.16,15.14
  Top 0.406: U$8.P$4 34.92,63.95 37.41,61.56 C20.-
  Bottom 0.203: 66.91,67.09 66.55,67.09 | 73.35,76.13 73.35,76.74 | 71.73,38.5 U$3.60 72.73,38.5 72.93,38.5 73.11,38.48 | U$3.38 79.23,31.6 79.23,31.7 79.18,31.84 | 24.93,39.1 24.83,39.1 24.73,39.2 22.04,30.91 21.64,30.51 21.64,22.61 22.04,22.61 U$2.4 | v49.91,23.59 50,23.48 | v49.98,20.66 49.98,20.64 | C21.2 49.17,15.12 v49.16,15.14
  Bottom 0.61: 69.61,42.41 72.14,42.44
  other vias: 75.16,72.41 79.05,72.42 77.96,36.73 83.52,42.06 55.05,33.5 45.13,52.66 54.63,51.79 47.78,45.45 37.66,48.76 51.65,30.63 41.81,31.24 56.07,12.04 59.33,47.77 69.09,50.17 89.57,32.43 87.82,17.99 86.59,12.8 86.79,7.44 83.97,5.05 96.23,9.62 99.53,11.76 103.22,13.99 95.57,15.22 84.06,17.07
  pour Bottom (rank 4): 71.75,80.18 71.82,0.13 120.78,0.19 120.07,79.38
  pour Bottom (rank 4): 24.66,1.7 70.57,1.38 70.19,68.04 36.56,64 24.04,37.17
  pour Top (rank 2): 117.64,74.18 117.64,2.17 70.87,2.09 70.87,74.09
  pour Top (rank 5): 34.41,58.79 24.24,37.65 25.53,1 69.84,1.17 70.09,67.05 41.49,66.1 34.38,62.8
GNDA  (via drill 0.6)
  Top 0.203: R35.1 21.76,67.8 21.88,65.64 20.86,63.58 C22.2
  Top 0.406: U$8.P$1 27.27,64.22 27.62,63.17 C26.2 | 23.61,63.13 24.21,63.02 | C22.2 20.79,63.55 | v6.32,20.56 v11.38,20.42
  Top 0.813: 24.21,63.02 C26.2
  Top 1.93: 20.79,63.55 23.61,63.13
  Bottom 0.203: 12.59,22.31 12.44,22.61 U$2.5
  Bottom 0.406: v11.38,20.42 12.59,22.31 | 5.38,19.29 v6.32,20.56
  pour Bottom (rank 3): 0.62,63.8 13.92,64.95 17.06,64.12 21.61,63.08 22.32,61.03 7.46,15.64 15.96,8.57 16.31,1.47 1.58,1.33 0.93,7.46
IBIAS  (via drill 0.6)
  Top 0.203: v68.63,45.2 70.13,43.7 70.13,38.86 69.85,37.62 v69.59,37.5
  Bottom 0.203: v68.63,45.2 67.83,45.2 RB1.1 | v69.59,37.5 69.79,37.41 69.37,37.69 69.37,37.7 69.79,37.42 70.48,37.27 71.17,36.99 71.73,37 U$3.57
ICMP  (via drill 0.6)
  Top 0.203: v68.1,38.7 67.71,39.04 v65.73,44.1
  Bottom 0.203: RB2.2 65.53,48.5 65.53,45.9 RB1.2 65.73,44.9 v65.73,44.1 | v68.1,38.7 69.71,38.43 70.85,37.99 71.33,37.49 71.73,37.5 U$3.58
ISOMD
  Bottom 0.203: U$3.55 71.73,36 71.13,36 70.95,36.06 63.05,36.06 60,36.13 58.78,37.73 58.91,38.92 58.99,39.68 58.93,43.6 59.66,45.61 61.33,45.62 61.3,45.62 | R48.1 61.28,44.78 61.3,45.62 | 61.3,45.62 R49.1
ISOSPI-A-N
  Top 0.203: U$5.P$6 59.46,78.19 50.5,79.26 14.81,79.27 9.13,74.23 7.45,71.68 7.45,69.14 8.3,68.43 9.87,67.73 U$9.8
ISOSPI-A-P
  Top 0.203: U$5.P$7 56.93,77.86 50.65,78.82 15.1,78.82 9.5,73.72 7.97,71.33 8.01,69.39 9.44,68.91 11.38,68.98 12.39,67.77 U$9.7
ISOSPI-B-N
  Top 0.203: U$5.P$9 51.83,77.88 50.32,78.28 43.12,78.32 15.17,78.23 9.96,73.07 U$9.10
ISOSPI-B-P
  Top 0.203: U$5.P$10 46.18,77.38 43.68,77.85 15.93,77.72 12.4,70.18 U$9.9
JTCK
  Top 0.203: U1.49 42.13,13.2 42.13,6.2 JP1.3
JTMS
  Top 0.203: 40.73,16.7 U1.46 38.1,16.69 38.1,16.7 37.56,16.39 37.18,11.52 36.72,7.9 JP1.1
LED_BUS_PWR
  Top 0.203: LED1.C 20.08,70.26 18.72,69.28 18.72,67.77 R35.2
LED|R
  Top 0.203: LED2.A 49.12,4.94 49.97,7.53 50.04,8.37 R7.2
N$1  (via drill 0.6)
  Top 0.203: U$5.P$1 49.28,61.36 47.06,61.15 47.07,59.73 47.89,59.76 R45.2 47.98,59.83 v47.95,49.86 | v58.12,45.24 v60.79,41.01
  Bottom 0.203: U$3.64 71.73,40.5 70.57,40.51 69.64,41.05 68.71,41.38 63.7,42.16 61.61,41.47 v60.79,41.01 | v47.95,49.86 v58.12,45.24
N$3
  Bottom 0.203: U$13.5 15.33,8.5 9.73,8.5 9.63,8.4 9.63,8 8.83,8 JP4.3
N$4  (via drill 0.6)
  Top 0.203: U$5.P$2 51.85,61.33 49.97,59.85 R45.1 50.09,59.81 50.1,49.43 v49.41,48.01 | v60.07,39.55 58.91,41.16 v57.43,43.67
  Bottom 0.203: U$3.63 70.3,39.99 69.84,40.02 69.15,40.71 68.53,40.86 65.9,41.33 63.73,41.64 v60.07,39.55 | v57.43,43.67 53.84,46.32 v49.41,48.01
N$6
  Top 0.203: U$5.P$4 56.88,62.88 R2.2 57,59.67 | R6.2 57,59.67 | 57,59.67 57,59.55
N$8
  Bottom 0.203: U$1.5 15.03,3.2 10.33,3.2 9.63,3.9 9.63,4.2 8.83,4.2 JP4.4
N$10
  Bottom 0.203: R3.1 30.63,4.8 27.73,4.8 U$1.1
N$11
  Bottom 0.203: R47.1 31.13,8.7 31.13,9.8 27.93,9.8 U$13.1
N$12
  Bottom 0.203: Q12.3 26.83,20.6 26.83,16.1 25.93,16.1 25.23,15.4 24.23,15.4 23.63,14.8 23.63,1.1 25.43,1.1 26.33,2 U$1.3
N$13
  Bottom 0.203: Q2.3 26.63,14.2 26.63,11 25.43,11 25.23,10.8 24.23,10.8 24.13,10.7 24.13,7.3 25.83,7.3 U$13.3
N$14  (via drill 0.6)
  Top 0.203: v37.93,19.6 38.53,20.2 38.53,21.7 39.63,21.7 U1.36
  Bottom 0.203: v37.93,19.6 34.83,16.5 32.23,16.5 31.73,16 29.53,16 Q2.1
N$15  (via drill 0.6)
  Top 0.203: v31.83,21.9 32.33,22.4 32.33,23.1 33.03,23.8 38.23,23.8 38.23,22.5 38.53,22.2 39.63,22.2 U1.35
  Bottom 0.203: v31.83,21.9 29.63,21.9 Q12.1
NPN_COL  (via drill 0.6)
  Top 0.203: v55.88,39.12 56.72,37.6 56.73,36.7 56.73,32.1 U$4.3
  Bottom 0.203: R4.2 49.83,40.6 49.83,41.6 54.03,41.6 C37.1 54.73,40.9 v55.88,39.12 55.88,37.18 R5.2
NRST  (via drill 0.6)
  Top 0.203: SW1.P$1 52.18,6.29 | 52.18,6.29 SW1.P$2 | 52.18,6.29 52.2,7.26 53.2,7.51 | R17.1 53.29,8.28 53.2,7.51 | U1.7 52.57,18.69 v53.51,19.15 | v54.91,8.36 54.25,7.42 53.19,7.51 53.2,7.51
  Bottom 0.203: v53.51,19.15 53.64,12 54.83,10.37 v54.91,8.36
PA2|WDT  (via drill 0.6)
  Top 0.203: v68,37.11 71.04,33 72.86,28.62 72.88,27.74 72.34,26.62 v71.18,24.3 | v66.75,24.35 54.64,24.13 52.77,23.19 51.65,23.19 | U1.16 51.65,23.19 | 51.65,23.19 51.65,23.17
  Bottom 0.203: U$3.56 71.19,36.48 69.24,36.56 v68,37.11 | v66.75,24.35 v71.18,24.3
PA9_USART1_TX
  Top 0.203: U1.42 39.63,18.7 37.49,18.66 36.84,19.57 35.25,22.13 34.34,22.53 JP3.5
PA10_USART1_RX
  Top 0.203: U1.43 39.63,18.2 37.32,18.19 35.95,19.51 34.52,20.01 34.09,20.08 JP3.4
PA11_CANRXD  (via drill 0.6)
  Top 0.203: U1.44 40.73,17.7 37.36,17.7 34.41,18.83 31.5,18.84 26.36,25.87 26.17,27.02 v26.14,27.19
  Bottom 0.203: v26.14,27.19 24.96,27.36 U$2.2
PA12-CANTXD  (via drill 0.6)
  Top 0.203: U1.45 37.73,17.19 37.73,17.18 34.81,16.34 31.54,16.34 v26.04,23.84
  Bottom 0.203: v26.04,23.84 25.67,24.71 23.51,24.77 U$2.3
PB8|LED
  Top 0.203: U1.61 48.14,9.68 47.15,9.32 LED2.C
PB11|VCAP  (via drill 0.6)
  Top 0.203: U1.30 43.14,26.87 v43.17,26.86
  Bottom 0.203: C8.1 41.6,26.9 C7.1 43.18,26.88 v43.17,26.86
PD0_OSC_IN_XTAL
  Top 0.203: U1.5 52.13,17.7 55.53,17.7 55.53,17.6 R1.1 C1.1 56.43,15.4 59.73,15.4 Q1.2
PD1_OSC_OUT
  Top 0.203: U1.6 52.13,18.2 55.53,18.2 55.53,18.4 R1.2 56.03,19.9 C2.1 56.43,20.2 59.73,20.2 Q1.1
S1
  Bottom 0.203: U$3.37 79.66,30.48 79.68,24.82 77.15,19.88 77.01,5.79 78.77,3.24 94.86,3.18 97.08,4.82 RS1.2
S2
  Bottom 0.203: U$3.35 80.67,31 80.67,24.38 78.62,19.85 78.56,7.1 79.85,6.06 98.94,6.04 106.14,4.01 109.08,4.06 110.97,5.53 RS2.2
S3
  Bottom 0.203: U$3.33 81.69,24.16 79.84,19.68 79.84,16.43 79.87,10.15 81.13,9.05 91.73,9.12 93.95,10.34 RS3.2
S4
  Bottom 0.203: U$3.31 84.37,33.48 84.37,33.47 84.56,33.46 84.57,30 82.72,28.97 82.74,23.98 81.07,19.35 81.11,12.35 81.67,11.69 89.09,11.7 95.12,11.69 99.73,10.37 104.83,10.28 RS4.2
S5
  Bottom 0.203: U$3.29 85.44,34.48 85.51,29.28 83.68,28.37 83.66,23.78 82.68,19.42 82.72,14.98 83.47,14.37 92.55,14.54 93.68,15.77 RS5.2
S6
  Bottom 0.203: U$3.27 84.13,35.5 86.49,35.5 86.49,28.61 84.71,27.65 84.61,23.69 83.88,19.19 84,18.43 85.18,17.11 89.81,17.04 94.96,17.06 102.38,17.49 104.2,19.07 RS6.2
S7
  Bottom 0.203: U$3.25 87.57,36.48 87.57,36.27 87.54,36.27 87.54,28.05 85.77,26.96 85.62,23.76 85.49,20.66 86.35,19.67 87.66,19.68 90.26,21.19 RS7.2
S8
  Bottom 0.203: U$3.23 89.11,37.48 89.11,37.43 94.36,23.82 95.11,23.13 96.24,23.13 97.45,24.11 RS8.2
S9
  Bottom 0.203: U$3.21 89.25,38.5 90.32,38.52 94.84,29.7 96.82,29.04 98.27,29.08 99.25,30.14 RS9.2
S10
  Bottom 0.203: 82.53,41.2 82.63,41.2 82.63,39.5 83.13,39.5 U$3.19 87.09,39.48 91.32,39.42 93.44,35.18 93.85,34.6 95.12,34.6 96,35.39 97.75,35.86 RS10.2
S11
  Bottom 0.203: U$3.17 91.36,40.48 92.58,40.82 95.26,40.72 97.91,42.14 RS11.2
S12
  Bottom 0.203: U$3.15 81.18,44.29 82.01,44.89 84.97,45.04 90.26,45.75 91.87,47.22 93.86,47.39 RS12.2
S13
  Bottom 0.203: RS13.2 102.68,54.37 100.58,52.67 87.6,51.69 80.13,48.89 80.19,42.58 80.23,42.5 U$3.13
S14
  Bottom 0.203: U$3.11 79.18,49.36 80.89,51.81 84.1,52.18 86.33,52.81 87.24,54.29 RS14.2
S15
  Bottom 0.203: U$3.9 78.22,49.52 79.98,56.87 87.76,57.71 95.36,57.7 100.78,59.31 102.39,60.88 RS15.2
S16
  Bottom 0.203: U$3.7 77.19,49.9 78.63,58.49 86.02,59.33 87.07,60.72 RS16.2
S17
  Bottom 0.203: U$3.5 76.19,49.18 76.72,62.36 92.27,62.77 99.63,64.84 101.34,66.54 RS17.2
S18
  Bottom 0.203: U$3.3 75.18,50.85 75.39,64.28 83.63,64.27 85.87,66.54 RS18.2
SP1_MISO-SDO  (via drill 0.6)
  Top 0.203: U1.22 47.15,25.29 47.14,26.03 47.14,27.58 v47.22,34.04
  Bottom 0.203: U$3.54 68.73,35.48 67.6,35.57 48.13,35.71 48.24,33.98 48.27,33.98 | R46.1 49.05,33.93 48.27,33.98 | 48.27,33.98 48.27,33.99 v47.22,34.04
SP1_NSS-CSB  (via drill 0.6, 0.9)
  Top 0.203: U$5.P$5 59.51,62.78 v59.44,58.24 60.02,57.9 60.12,57.9 62.21,53.66 63.88,42.48 v66.28,38.98 | v59.01,55.61 58.77,55.42 58.42,55.2 56.92,53.7 50.18,37.52 50.59,31.01 50.23,30.82 | 50.23,30.82 50.18,30.8 | U1.20 48.13,25.7 48.12,29.35 50.22,30.84 50.23,30.82 | R6.1 53.63,57.97 v53.63,56.43
  Bottom 0.203: v59.01,55.61 59.19,56.73 | 59.19,56.73 v59.44,58.24 | v66.28,38.98 66.82,39.37 68.19,39.62 69.53,39 71.73,39 U$3.61 | 59.19,56.73 59.23,56.73 59.23,56.43 v53.63,56.43
SPI1_MOSI-SDI  (via drill 0.6)
  Top 0.203: v46.25,32.79 46.68,31.6 46.65,25.31 U1.23
  Bottom 0.203: U$3.53 71.73,35 71.43,35 68.42,35.04 67.04,35.09 63,35.16 54.38,35.15 53.45,32.72 v46.25,32.79
SPI1_SCK-CLK  (via drill 0.6)
  Top 0.203: R2.1 57.02,57.83 | R2.1 56.42,57.5 53.82,54.9 53.35,54.58 53.22,54 51.61,46.67 49.73,40.33 48.77,38.39 48.39,35.07 47.66,31.67 | R2.1 57.42,58.4 | U1.21 47.63,24.6 | 47.66,31.67 47.65,31.61 U1.21 | U1.21 47.65,25.1 | v60.3,37.91 58.47,37.68 v58.2,34.02 | v48.85,31.66 48.51,31.63 47.69,31.66 47.66,31.67
  Bottom 0.203: U$3.62 71.74,39.47 69.67,39.51 68.72,40.32 65.75,40.88 63.87,41.06 v60.3,37.91 | v58.2,34.02 54.27,31.89 v48.85,31.66
VCC  (via drill 0.6)
  Top 0.203: 53.13,29.49 53.13,29.5 | 52.73,34.02 52.77,34.02 v52.19,34.01 | v38.4,10.06 39.75,11.88 | v48.51,23.19 48.66,24.1 U1.19 | U1.13 51.62,21.68 50.52,21.71 v49.96,22.09 | 50.51,15.69 U1.1 | v49.13,19.34 48.34,19.25 | v52.02,14.55 v52.03,14.54 | R17.2 53.15,11.08 52.66,11.75 | R7.1 50.02,11.06 50.44,11.59 | v44.17,8.4 R8.2
  Top 0.406: v61.02,51.9 58.1,50.03 53.58,38.17 52.73,34.02 52.73,30.4 53.13,30 53.13,29.5 | C6.1 65.55,57.78 64.63,55.42 U$11.4
  Bottom 0.203: 61.32,51.9 v61.02,51.9 60.12,51.9 | R3.2 32.83,5.6 v32.83,6.4 32.83,7.7 R47.2 34.94,8.31 v38.4,10.06 38.42,10.05 v44.17,8.4 | v52.19,34.01 R46.2 | C3.1 47.73,23.16 47.73,23.14 v48.51,23.19 | C5.1 v49.96,22.09 | C21.1 v49.13,19.34 | C4.1 v52.02,14.55
  Bottom 0.305: U$11.4 64.11,54.31 63.62,54.2
  Bottom 0.406: 61.32,51.9 63.62,54.2
  other vias: 45.41,28.58 45.45,27.35 49.23,28.66
  pour Top (rank 2): 38.8,29.21 39.14,11.24 53.29,11.29 53.25,29.59
  pour Bottom (rank 2): 44.38,28.81 44.35,27.02 45.01,26.32 45.94,26.41 50.08,27.93 50.14,29.14 49.66,29.52 45.9,29.42 44.98,29.36
VREF1
  Bottom 0.203: C35.1 65.73,30.6 65.73,32.3 67.63,32.3 69.33,34 71.73,34 U$3.51
VREF2
  Bottom 0.203: R50.2 63.33,7.1 63.33,9.4 R51.2 63.53,10.4 63.53,25.1 65.53,25.1 65.63,25.2 65.63,26.2 C34.1 65.93,27.1 65.93,28.7 66.53,28.7 68.43,30.6 68.43,32.5 69.03,32.5 69.83,33.3 71.23,33.3 71.43,33.5 71.73,33.5 U$3.50
VREG  (via drill 0.6)
  Top 0.203: v60.83,49.85 60.97,49 62.53,42.16 61.83,39.14 61.94,37.06 62.93,34.7 62.93,34.6 66.53,34.6 v67.06,34.24 66.93,34.4 66.93,32.2 U$4.2 68.03,31.2 v69.33,31.2
  Bottom 0.203: v60.83,49.85 60.85,49.77 R49.2 | 67.03,34.5 71.73,34.5 U$3.52 | 67.03,34.5 66.23,34.5 66.23,34.2 C36.1 | v69.33,31.2 74.13,31.2 U$3.48 | v67.06,34.24 67.03,34.5
VSS_1  (via drill 0.6)
  Top 0.203: 42.63,25.7 U1.31 42.67,23.58 v42.59,23.66
  Bottom 0.203: v42.59,23.66 42.69,23.61 C11.1
VSS_2  (via drill 0.6)
  Top 0.203: U1.47 v41.72,16.15
  Bottom 0.203: C13.1 42.49,16.2 42.49,16.19 v41.72,16.15
X1
  Top 0.203: RC1.1 92.66,7.31 RS1.1
  Bottom 0.203: RS1.1 103.16,6.84 105.94,4.6 107.89,4.58 108.9,5.5 109.32,7.04 111.9,6.99 115.17,9.78 115.21,18.54 115.07,21.39 113.66,23.01 U$12.2
X2
  Top 0.203: RC2.1 111.04,8.29 RS2.1 110.96,8.26 113.63,10.37 113.63,15.91 109.07,18.35 109.12,26.02 U$12.3
X3  (via drill 0.6)
  Top 0.203: RC3.1 93.99,12.85 RS3.1 93.97,12.78 v102.32,15.59 | v107.45,18.24 v107.72,22.73
  Bottom 0.203: U$12.4 110.65,27 109.16,25.91 109.1,23.63 v107.72,22.73 | v102.32,15.59 v107.45,18.24
X4
  Top 0.203: U$12.5 106.31,28.54 105.66,27.4 105.7,23.56 105.61,17.97 107.08,14.77 | RC4.1 107.08,14.77 | RS4.1 111.03,14.9 107.08,14.77
X5  (via drill 0.6)
  Top 0.203: v113.13,27.3 113.06,21.18 v112.79,19.48 | RC5.1 93.7,18.29 RS5.1 97.33,15.87 102.58,16.84 v104.95,15.76
  Bottom 0.203: v113.13,27.3 112.13,28.3 111.03,28.3 111.03,28.5 U$12.6 | v112.79,19.48 112.84,19.49 v104.95,15.76
X6
  Top 0.203: U$12.7 106.73,31.2 106.17,29.93 104.27,28.14 104.15,21.59 RS6.1 104.2,21.64 RC6.1
X7  (via drill 0.6)
  Top 0.203: RS7.1 90.21,23.67 RC7.1 | v114.07,20.95 113.79,22.1 113.68,24.27 113.69,26.35 114.18,27.76 v113.59,28.82
  Bottom 0.203: RS7.1 95.91,21.69 100.06,20.53 110.19,20.18 112.3,20.98 v114.07,20.95 | U$12.8 110.5,31.45 v113.59,28.82
X8
  Top 0.203: U$12.9 106.73,33.4 102.88,28.44 100.66,27.23 RS8.1 100.73,27.31 RC8.1
X9  (via drill 0.6)
  Top 0.203: v112.04,21.91 112.23,24.2 112.23,33.4 111.33,33.4 U$12.10 | RS9.1 101.76,32.92 RC9.1
  Bottom 0.203: 106.31,21.82 106.13,23 | 106.31,21.82 v112.04,21.91 | 106.31,21.82 106.18,22.96 105,25.64 104.96,25.7 104.86,26.2 103.89,32.21 101.66,33 RS9.1
X10
  Top 0.203: U$12.11 103.92,38.31 97.68,38.43 RS10.1 94.53,38.5 RC10.1
X11
  Bottom 0.203: RC11.1 96.02,44.57 RS11.1 99.41,45.19 105.88,50.5 111.74,50.62 111.94,37.09 U$12.12
X12
  Top 0.203: U$12.13 105.08,41.47 103.93,45.03 98.6,49.5 97.21,50.05 93.75,49.89 RS12.1 93.8,49.89 RC12.1
X13
  Top 0.203: U$12.14 108.81,39.58 108.77,51.69 105.19,54.41 RS13.1
  Bottom 0.203: RC13.1 100.99,55.63 104.52,55.53 105.24,54.37 RS13.1
X14
  Top 0.203: U$12.15 105.78,41.98 105.59,43.03 104.61,45.24 99.12,50.45 91.7,52.86 89.75,54.38 RS14.1
  Bottom 0.203: RC14.1 85.54,55.65 88.69,55.47 89.86,54.34 RS14.1
X15
  Top 0.203: U$12.16 109.24,41.78 109.24,52.07 108.44,57.87 104.72,60.94 RS15.1
  Bottom 0.203: RC15.1 99.72,62.26 103.42,62.1 104.76,60.93 RS15.1
X16
  Top 0.203: U$12.17 105.78,44.09 105.45,45.57 99.9,51.34 100.57,54.46 99.9,57.14 90.67,59.06 89.56,60.84 RS16.1
  Bottom 0.203: RC16.1 84.18,62.06 88.78,62.01 89.67,60.79 RS16.1
X17
  Top 0.203: U$12.18 112.19,43.75 111.92,63.46 103.89,66.5 RS17.1
  Bottom 0.203: RC17.1 98.72,68.11 103.04,68.09 103.81,66.54 RS17.1
X18  (via drill 0.6)
  Top 0.203: 88.47,66.59 88.47,67.91 82.37,67.91 82.37,66.5 | 88.47,66.59 88.47,66.57 RS18.1 88.47,66.59 | 82.37,66.5 82.37,66.49 | RC18.1 82.37,66.5 | U$12.19 101.43,51.07 101.29,56.19 100.2,63.44 89.59,65 88.47,66.59 | v51.56,37.43 v58.31,53.58
  Bottom 0.203: 74.2,65.48 74.16,43.69 74.18,43.69 U$3.1 74.13,42.5 | 74.2,65.48 74.21,69.6 77.73,69.78 78.7,69.69 80.28,69.69 82.48,66.5 | 82.48,66.5 82.48,66.55 | 82.48,66.5 RC18.1 | R5.1 v51.56,37.43 | v58.31,53.58 60.42,54.2 62.67,59.77 64.34,63.58 69.69,65.41 74.23,65.48 74.2,65.48

### Text on the board
bNames: 5
tValues: 3.3V | DIGITAL | +5V | 3.2v | ANALOG | 3.2